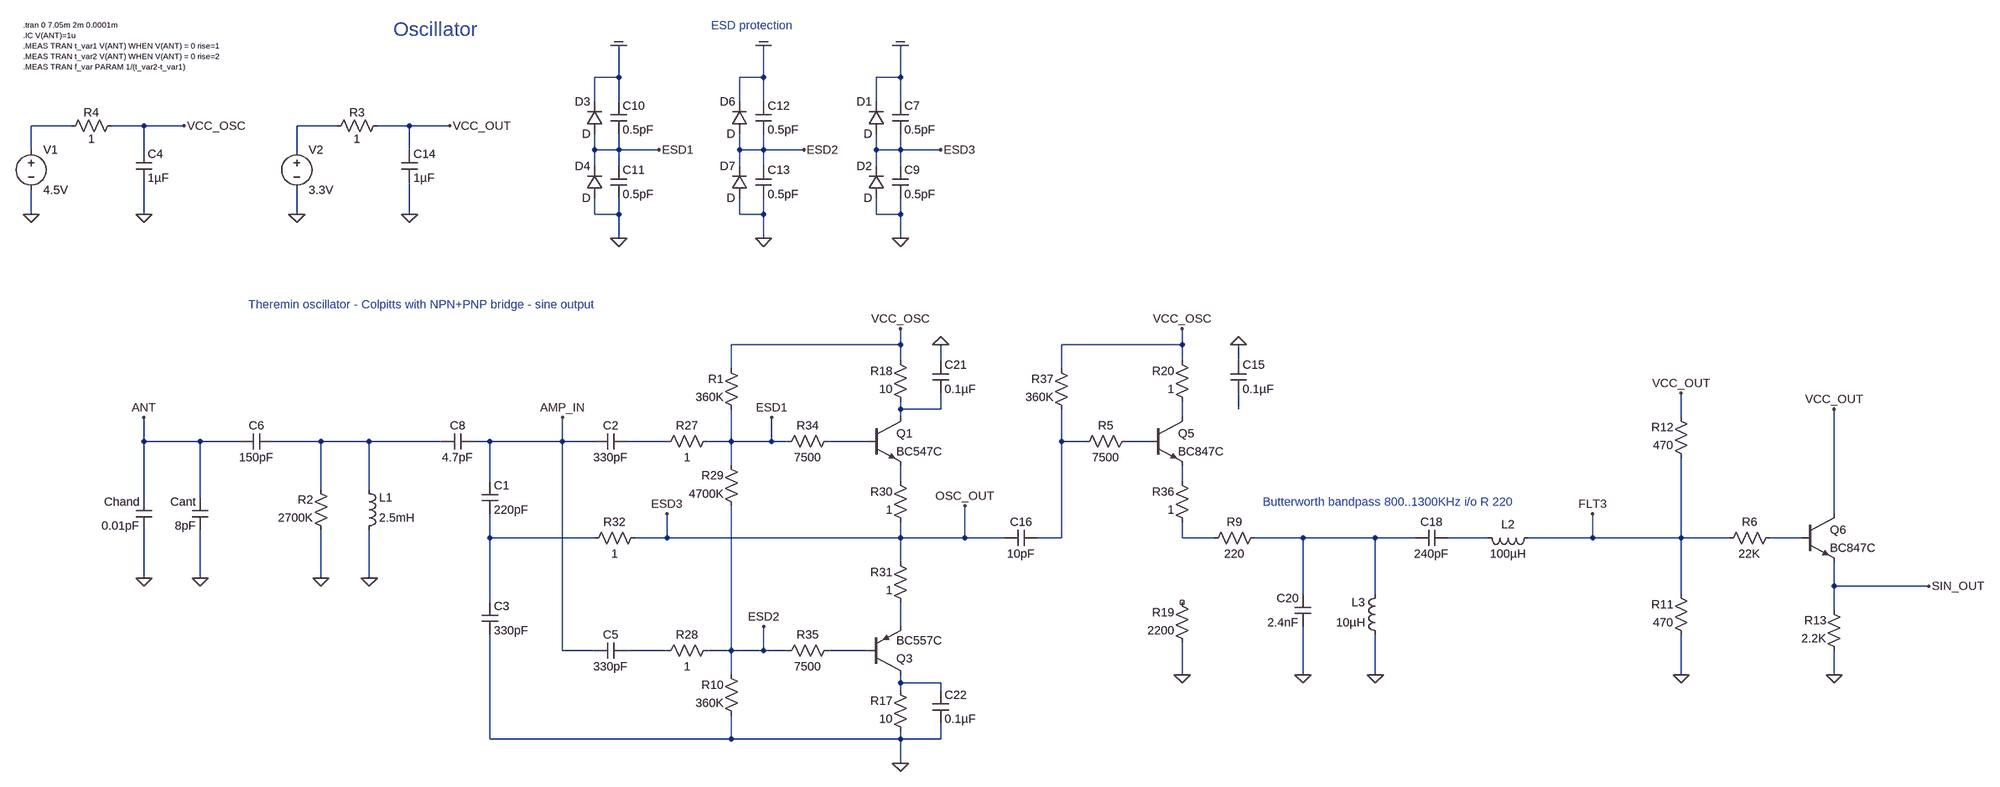
[diagram p0: schematic 2020_npn_pnp_advanced_osc_sine_out_filtered_v4.asc]
2020_npn_pnp_advanced_osc_sine_out_filtered_v4.asc, the LTspice schematic file:
Version 4
SHEET 1 3876 2724
WIRE 176 -96 176 -160
WIRE 176 -96 128 -96
WIRE 464 -96 464 -160
WIRE 464 -96 416 -96
WIRE 736 -96 736 -160
WIRE 736 -96 688 -96
WIRE 128 -48 128 -96
WIRE 176 -48 176 -96
WIRE 416 -48 416 -96
WIRE 464 -48 464 -96
WIRE 688 -48 688 -96
WIRE 736 -48 736 -96
WIRE -912 0 -992 0
WIRE -768 0 -832 0
WIRE -688 0 -768 0
WIRE -384 0 -464 0
WIRE -240 0 -304 0
WIRE -160 0 -240 0
WIRE -992 48 -992 0
WIRE -768 48 -768 0
WIRE -464 48 -464 0
WIRE -240 48 -240 0
WIRE 128 48 128 16
WIRE 176 48 176 16
WIRE 176 48 128 48
WIRE 256 48 176 48
WIRE 416 48 416 16
WIRE 464 48 464 16
WIRE 464 48 416 48
WIRE 544 48 464 48
WIRE 688 48 688 16
WIRE 736 48 736 16
WIRE 736 48 688 48
WIRE 816 48 736 48
WIRE 128 80 128 48
WIRE 176 80 176 48
WIRE 416 80 416 48
WIRE 464 80 464 48
WIRE 688 80 688 48
WIRE 736 80 736 48
WIRE -992 176 -992 128
WIRE -768 176 -768 112
WIRE -464 176 -464 128
WIRE -240 176 -240 112
WIRE 128 176 128 144
WIRE 176 176 176 144
WIRE 176 176 128 176
WIRE 416 176 416 144
WIRE 464 176 464 144
WIRE 464 176 416 176
WIRE 688 176 688 144
WIRE 736 176 736 144
WIRE 736 176 688 176
WIRE 176 224 176 176
WIRE 464 224 464 176
WIRE 736 224 736 176
WIRE 736 464 736 432
WIRE 736 464 400 464
WIRE 1296 464 1296 432
WIRE 1296 464 1056 464
WIRE 736 496 736 464
WIRE 816 496 816 464
WIRE 1296 496 1296 464
WIRE 1408 496 1408 464
WIRE 400 512 400 464
WIRE 1056 512 1056 464
WIRE 736 592 736 576
WIRE 816 592 816 560
WIRE 816 592 736 592
WIRE 1408 592 1408 560
WIRE 736 608 736 592
WIRE 1296 608 1296 576
WIRE 2288 608 2288 560
WIRE -768 656 -768 608
WIRE -656 656 -768 656
WIRE -576 656 -656 656
WIRE -416 656 -512 656
WIRE -320 656 -416 656
WIRE -176 656 -320 656
WIRE -80 656 -112 656
WIRE 64 656 64 608
WIRE 64 656 -80 656
WIRE 128 656 64 656
WIRE 272 656 192 656
WIRE 400 656 400 592
WIRE 400 656 352 656
WIRE 480 656 480 608
WIRE 480 656 400 656
WIRE 512 656 480 656
WIRE 672 656 592 656
WIRE 1056 656 1056 592
WIRE 1104 656 1056 656
WIRE 1232 656 1184 656
WIRE 400 704 400 656
WIRE -80 736 -80 656
WIRE 736 736 736 704
WIRE 1296 736 1296 704
WIRE -416 752 -416 656
WIRE -320 752 -320 656
WIRE -768 768 -768 656
WIRE -656 768 -656 656
WIRE 2592 800 2592 592
WIRE -80 848 -80 800
WIRE 128 848 -80 848
WIRE 272 848 272 800
WIRE 272 848 208 848
WIRE 736 848 736 816
WIRE 736 848 272 848
WIRE 864 848 864 784
WIRE 864 848 736 848
WIRE 944 848 864 848
WIRE 1056 848 1056 656
WIRE 1056 848 1008 848
WIRE 1296 848 1296 816
WIRE 1360 848 1296 848
WIRE 1536 848 1440 848
WIRE 1680 848 1536 848
WIRE 1760 848 1680 848
WIRE 1904 848 1824 848
WIRE 2112 848 2112 800
WIRE 2112 848 1984 848
WIRE 2288 848 2288 688
WIRE 2288 848 2112 848
WIRE 2384 848 2288 848
WIRE 2528 848 2464 848
WIRE 736 896 736 848
WIRE -768 928 -768 832
WIRE -656 928 -656 832
WIRE -416 928 -416 832
WIRE -320 928 -320 832
WIRE 2592 944 2592 896
WIRE 2800 944 2592 944
WIRE 1536 960 1536 848
WIRE 1680 960 1680 848
WIRE 2288 960 2288 848
WIRE -80 976 -80 848
WIRE 2592 992 2592 944
WIRE 736 1024 736 976
WIRE 64 1072 64 656
WIRE 128 1072 64 1072
WIRE 272 1072 192 1072
WIRE 400 1072 400 784
WIRE 400 1072 352 1072
WIRE 464 1072 464 1024
WIRE 464 1072 400 1072
WIRE 512 1072 464 1072
WIRE 672 1072 592 1072
WIRE 400 1120 400 1072
WIRE 1296 1120 1296 1056
WIRE 1536 1120 1536 1024
WIRE 1680 1120 1680 1040
WIRE 2288 1120 2288 1040
WIRE 2592 1120 2592 1072
WIRE 736 1136 736 1120
WIRE 816 1136 736 1136
WIRE 736 1152 736 1136
WIRE 816 1152 816 1136
WIRE -80 1248 -80 1040
WIRE 400 1248 400 1200
WIRE 400 1248 -80 1248
WIRE 736 1248 736 1232
WIRE 736 1248 400 1248
WIRE 816 1248 816 1216
WIRE 816 1248 736 1248
WIRE 736 1296 736 1248
FLAG -992 176 0
FLAG -768 928 0
FLAG -768 608 ANT
FLAG 176 224 0
FLAG 176 -160 COM
FLAG 256 48 ESD1
FLAG 464 224 0
FLAG 464 -160 COM
FLAG 544 48 ESD2
FLAG -656 928 0
FLAG 480 608 ESD1
FLAG -768 176 0
FLAG -416 928 0
FLAG -320 928 0
FLAG -688 0 VCC_OSC
FLAG 736 432 VCC_OSC
FLAG 864 784 OSC_OUT
FLAG 736 1296 0
FLAG 464 1024 ESD2
FLAG 736 224 0
FLAG 736 -160 COM
FLAG 816 48 ESD3
FLAG 272 800 ESD3
FLAG 64 608 AMP_IN
FLAG 2112 800 FLT3
FLAG 2592 592 VCC_OUT
FLAG 2592 1120 0
FLAG 2800 944 SIN_OUT
FLAG 1296 432 VCC_OSC
FLAG 1296 1120 0
FLAG 1680 1120 0
FLAG 1536 1120 0
FLAG 816 464 0
FLAG -464 176 0
FLAG -240 176 0
FLAG -160 0 VCC_OUT
FLAG 1408 464 0
FLAG 2288 1120 0
FLAG 2288 560 VCC_OUT
SYMBOL voltage -992 32 R0
WINDOW 123 0 0 Left 2
WINDOW 39 0 0 Left 2
SYMATTR InstName V1
SYMATTR Value 4.5V
SYMBOL ind -336 848 M180
WINDOW 0 36 80 Left 2
WINDOW 3 36 40 Left 2
SYMATTR InstName L1
SYMATTR Value 2.5mH
SYMATTR SpiceLine Ipk=0.1 Rser=120 Rpar=20Meg Cpar=1.286pF
SYMBOL cap -752 768 M0
SYMATTR InstName Chand
SYMATTR Value 0.01pF
SYMBOL diode 144 16 R180
WINDOW 0 24 64 Left 2
WINDOW 3 24 0 Left 2
SYMATTR InstName D3
SYMBOL diode 144 144 R180
WINDOW 0 24 64 Left 2
WINDOW 3 24 0 Left 2
SYMATTR InstName D4
SYMBOL cap 160 -48 R0
SYMATTR InstName C10
SYMATTR Value 0.5pF
SYMBOL cap 160 80 R0
SYMATTR InstName C11
SYMATTR Value 0.5pF
SYMBOL diode 432 16 R180
WINDOW 0 24 64 Left 2
WINDOW 3 24 0 Left 2
SYMATTR InstName D6
SYMBOL diode 432 144 R180
WINDOW 0 24 64 Left 2
WINDOW 3 24 0 Left 2
SYMATTR InstName D7
SYMBOL cap 448 -48 R0
SYMATTR InstName C12
SYMATTR Value 0.5pF
SYMBOL cap 448 80 R0
SYMATTR InstName C13
SYMATTR Value 0.5pF
SYMBOL cap -640 768 M0
SYMATTR InstName Cant
SYMATTR Value 8pF
SYMBOL res -816 -16 R90
WINDOW 0 5 56 VBottom 2
WINDOW 3 27 56 VTop 2
SYMATTR InstName R4
SYMATTR Value 1
SYMBOL cap -784 48 R0
SYMATTR InstName C4
SYMATTR Value 1µF
SYMBOL res 416 608 R180
WINDOW 0 31 76 Left 2
WINDOW 3 31 40 Left 2
SYMATTR InstName R1
SYMATTR Value 360K
SYMBOL res -400 848 R180
WINDOW 0 31 76 Left 2
WINDOW 3 31 40 Left 2
SYMATTR InstName R2
SYMATTR Value 2700K
SYMBOL cap -96 736 R0
SYMATTR InstName C1
SYMATTR Value 220pF
SYMBOL cap -96 976 R0
SYMATTR InstName C3
SYMATTR Value 330pF
SYMBOL npn 672 608 R0
SYMATTR InstName Q1
SYMATTR Value BC547C
SYMBOL cap -112 640 R90
WINDOW 0 0 32 VBottom 2
WINDOW 3 32 32 VTop 2
SYMATTR InstName C8
SYMATTR Value 4.7pF
SYMBOL pnp 672 1120 M180
SYMATTR InstName Q3
SYMATTR Value BC557C
SYMBOL res 416 1216 R180
WINDOW 0 31 76 Left 2
WINDOW 3 31 40 Left 2
SYMATTR InstName R10
SYMATTR Value 360K
SYMBOL cap 192 640 R90
WINDOW 0 0 32 VBottom 2
WINDOW 3 32 32 VTop 2
SYMATTR InstName C2
SYMATTR Value 330pF
SYMBOL cap 192 1056 R90
WINDOW 0 0 32 VBottom 2
WINDOW 3 32 32 VTop 2
SYMATTR InstName C5
SYMATTR Value 330pF
SYMBOL cap -512 640 R90
WINDOW 0 0 32 VBottom 2
WINDOW 3 32 32 VTop 2
SYMATTR InstName C6
SYMATTR Value 150pF
SYMBOL diode 704 16 R180
WINDOW 0 24 64 Left 2
WINDOW 3 24 0 Left 2
SYMATTR InstName D1
SYMBOL diode 704 144 R180
WINDOW 0 24 64 Left 2
WINDOW 3 24 0 Left 2
SYMATTR InstName D2
SYMBOL cap 720 -48 R0
SYMATTR InstName C7
SYMATTR Value 0.5pF
SYMBOL cap 720 80 R0
SYMATTR InstName C9
SYMATTR Value 0.5pF
SYMBOL res 2304 1056 R180
WINDOW 0 31 76 Left 2
WINDOW 3 31 40 Left 2
SYMATTR InstName R11
SYMATTR Value 470
SYMBOL npn 2528 800 R0
SYMATTR InstName Q6
SYMATTR Value BC847C
SYMBOL res 2304 704 R180
WINDOW 0 31 76 Left 2
WINDOW 3 31 40 Left 2
SYMATTR InstName R12
SYMATTR Value 470
SYMBOL res 2608 1088 R180
WINDOW 0 31 76 Left 2
WINDOW 3 31 40 Left 2
SYMATTR InstName R13
SYMATTR Value 2.2K
SYMBOL res 752 1248 R180
WINDOW 0 31 76 Left 2
WINDOW 3 31 40 Left 2
SYMATTR InstName R17
SYMATTR Value 10
SYMBOL res 752 592 R180
WINDOW 0 31 76 Left 2
WINDOW 3 31 40 Left 2
SYMATTR InstName R18
SYMATTR Value 10
SYMBOL npn 1232 608 R0
SYMATTR InstName Q5
SYMATTR Value BC847C
SYMBOL res 1312 1072 R180
WINDOW 0 31 76 Left 2
WINDOW 3 31 40 Left 2
SYMATTR InstName R19
SYMATTR Value 2200
SYMBOL res 1312 592 R180
WINDOW 0 31 76 Left 2
WINDOW 3 31 40 Left 2
SYMATTR InstName R20
SYMATTR Value 1
SYMBOL ind 2000 832 R90
WINDOW 0 5 56 VBottom 2
WINDOW 3 32 56 VTop 2
SYMATTR InstName L2
SYMATTR Value 100µH
SYMATTR SpiceLine Ipk=0.16 Rser=2.5
SYMBOL cap 1824 832 R90
WINDOW 0 0 32 VBottom 2
WINDOW 3 32 32 VTop 2
SYMATTR InstName C18
SYMATTR Value 240pF
SYMBOL cap 1552 1024 R180
WINDOW 0 24 56 Left 2
WINDOW 3 24 8 Left 2
SYMATTR InstName C20
SYMATTR Value 2.4nF
SYMBOL ind 1696 1056 R180
WINDOW 0 36 80 Left 2
WINDOW 3 36 40 Left 2
SYMATTR InstName L3
SYMATTR Value 10µH
SYMATTR SpiceLine Ipk=0.4 Rser=0.56
SYMBOL res 1344 864 R270
WINDOW 0 32 56 VTop 2
WINDOW 3 0 56 VBottom 2
SYMATTR InstName R9
SYMATTR Value 220
SYMBOL res 256 672 R270
WINDOW 0 32 56 VTop 2
WINDOW 3 0 56 VBottom 2
SYMATTR InstName R27
SYMATTR Value 1
SYMBOL res 256 1088 R270
WINDOW 0 32 56 VTop 2
WINDOW 3 0 56 VBottom 2
SYMATTR InstName R28
SYMATTR Value 1
SYMBOL res 416 800 R180
WINDOW 0 31 76 Left 2
WINDOW 3 31 40 Left 2
SYMATTR InstName R29
SYMATTR Value 4700K
SYMBOL res 752 832 R180
WINDOW 0 31 76 Left 2
WINDOW 3 31 40 Left 2
SYMATTR InstName R30
SYMATTR Value 1
SYMBOL res 752 992 R180
WINDOW 0 31 76 Left 2
WINDOW 3 31 40 Left 2
SYMATTR InstName R31
SYMATTR Value 1
SYMBOL res 112 864 R270
WINDOW 0 32 56 VTop 2
WINDOW 3 0 56 VBottom 2
SYMATTR InstName R32
SYMATTR Value 1
SYMBOL cap 800 496 R0
SYMATTR InstName C21
SYMATTR Value 0.1µF
SYMBOL cap 800 1152 R0
SYMATTR InstName C22
SYMATTR Value 0.1µF
SYMBOL res 496 672 R270
WINDOW 0 32 56 VTop 2
WINDOW 3 0 56 VBottom 2
SYMATTR InstName R34
SYMATTR Value 7500
SYMBOL res 496 1088 R270
WINDOW 0 32 56 VTop 2
WINDOW 3 0 56 VBottom 2
SYMATTR InstName R35
SYMATTR Value 7500
SYMBOL res 1312 832 R180
WINDOW 0 31 76 Left 2
WINDOW 3 31 40 Left 2
SYMATTR InstName R36
SYMATTR Value 1
SYMBOL res 1072 608 R180
WINDOW 0 31 76 Left 2
WINDOW 3 31 40 Left 2
SYMATTR InstName R37
SYMATTR Value 360K
SYMBOL voltage -464 32 R0
WINDOW 123 0 0 Left 2
WINDOW 39 0 0 Left 2
SYMATTR InstName V2
SYMATTR Value 3.3V
SYMBOL res -288 -16 R90
WINDOW 0 5 56 VBottom 2
WINDOW 3 27 56 VTop 2
SYMATTR InstName R3
SYMATTR Value 1
SYMBOL cap -256 48 R0
SYMATTR InstName C14
SYMATTR Value 1µF
SYMBOL cap 1392 496 R0
SYMATTR InstName C15
SYMATTR Value 0.1µF
SYMBOL res 1088 672 R270
WINDOW 0 32 56 VTop 2
WINDOW 3 0 56 VBottom 2
SYMATTR InstName R5
SYMATTR Value 7500
SYMBOL res 2368 864 R270
WINDOW 0 32 56 VTop 2
WINDOW 3 0 56 VBottom 2
SYMATTR InstName R6
SYMATTR Value 22K
SYMBOL cap 1008 832 R90
WINDOW 0 0 32 VBottom 2
WINDOW 3 32 32 VTop 2
SYMATTR InstName C16
SYMATTR Value 10pF
TEXT -1008 -200 Left 1 !.tran 0 7.05m 2m 0.0001m\n.IC V(ANT)=1u\n.MEAS TRAN t_var1 V(ANT) WHEN V(ANT) = 0 rise=1\n.MEAS TRAN t_var2 V(ANT) WHEN V(ANT) = 0 rise=2\n.MEAS TRAN f_var PARAM 1/(t_var2-t_var1)
TEXT 360 -200 Left 2 ;ESD protection
TEXT -272 -192 Left 4 ;Oscillator
TEXT -560 384 Left 2 ;Theremin oscillator - Colpitts with NPN+PNP bridge - sine output
TEXT 1456 776 Left 2 ;Butterworth bandpass 800..1300KHz i/o R 220

The netlist it stands for:
* 2020_npn_pnp_advanced_osc_sine_out_filtered_v4.asc
V1 N001 0 4.5V
L1 0 N006 2.5mH Ipk=0.1 Rser=120 Rpar=20Meg Cpar=1.286pF
Chand ANT 0 0.01pF
D3 ESD1 COM D
D4 0 ESD1 D
C10 COM ESD1 0.5pF
C11 ESD1 0 0.5pF
D6 ESD2 COM D
D7 0 ESD2 D
C12 COM ESD2 0.5pF
C13 ESD2 0 0.5pF
Cant ANT 0 8pF
R4 VCC_OSC N001 1
C4 VCC_OSC 0 1µF
R1 ESD1 VCC_OSC 360K
R2 0 N006 2700K
C1 AMP_IN N013 220pF
C3 N013 0 330pF
Q1 N003 N008 N011 0 BC547C
C8 AMP_IN N006 4.7pF
Q3 N021 N020 N018 0 BC557C
R10 0 ESD2 360K
C2 N007 AMP_IN 330pF
C5 N019 AMP_IN 330pF
C6 N006 ANT 150pF
D1 ESD3 COM D
D2 0 ESD3 D
C7 COM ESD3 0.5pF
C9 ESD3 0 0.5pF
R11 0 FLT3 470
Q6 VCC_OUT N017 SIN_OUT 0 BC847C
R12 FLT3 VCC_OUT 470
R13 0 SIN_OUT 2.2K
R17 0 N021 10
R18 N003 VCC_OSC 10
Q5 N005 N010 N012 0 BC847C
R19 0 NC_01 2200
R20 N005 VCC_OSC 1
L2 FLT3 N016 100µH Ipk=0.16 Rser=2.5
C18 N016 N015 240pF
C20 0 N015 2.4nF
L3 0 N015 10µH Ipk=0.4 Rser=0.56
R9 N014 N015 220
R27 N007 ESD1 1
R28 N019 ESD2 1
R29 ESD2 ESD1 4700K
R30 ESD3 N011 1
R31 N018 ESD3 1
R32 N013 ESD3 1
C21 0 N003 0.1µF
C22 N021 0 0.1µF
R34 ESD1 N008 7500
R35 ESD2 N020 7500
R36 N014 N012 1
R37 N009 VCC_OSC 360K
V2 N002 0 3.3V
R3 VCC_OUT N002 1
C14 VCC_OUT 0 1µF
C15 0 N004 0.1µF
R5 N009 N010 7500
R6 FLT3 N017 22K
C16 N009 ESD3 10pF
.model D D
.lib standard.dio
.model NPN NPN
.model PNP PNP
.lib standard.bjt
.tran 0 7.05m 2m 0.0001m
.IC V(ANT)=1u
.MEAS TRAN t_var1 V(ANT) WHEN V(ANT) = 0 rise=1
.MEAS TRAN t_var2 V(ANT) WHEN V(ANT) = 0 rise=2
.MEAS TRAN f_var PARAM 1/(t_var2-t_var1)
* ESD protection
* Oscillator
* Theremin oscillator - Colpitts with NPN+PNP bridge - sine output
* Butterworth bandpass 800..1300KHz i/o R 220
.backanno
.end